# Altium schematic sheet Power.SchDoc
size A3; SheetNumber: 3; SheetTotal: 3
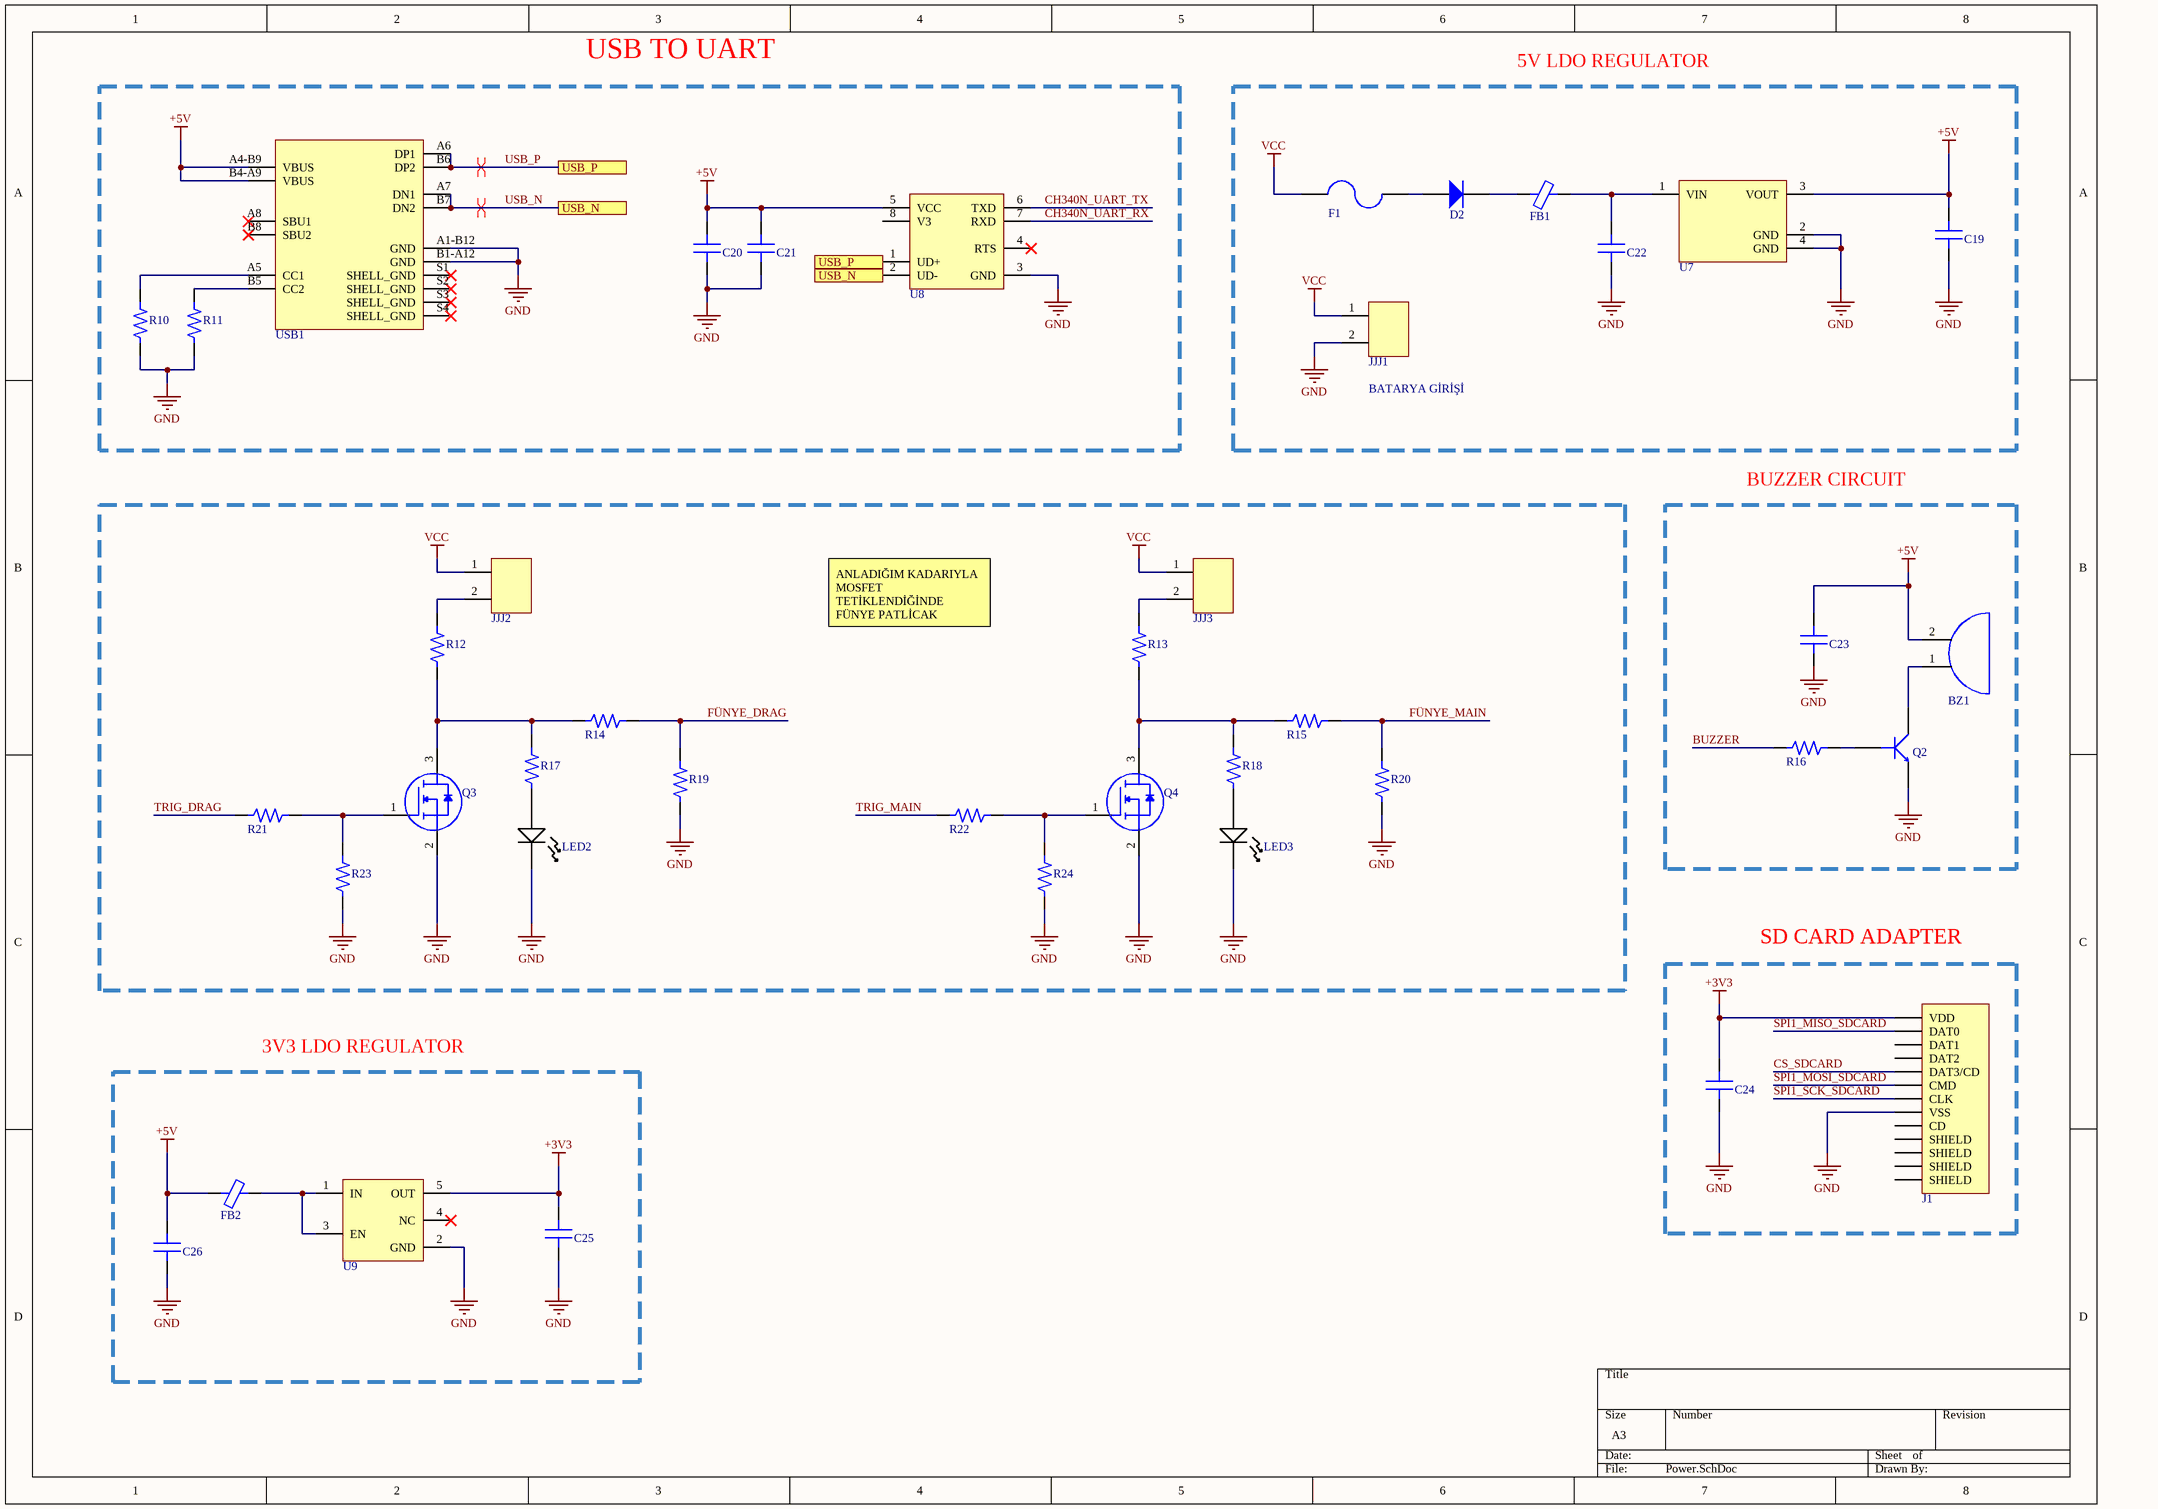
[diagram p0: Power.SchDoc]

## Parts
BZ1  CMI-9605IC-0580T  [BUZZER]  (value not drawn)
C19  CAP CER 10uF 0805  [CAP_0805]  (value not drawn)
C20  CAP CER 100nF 0805  [CAP_0805]  (value not drawn)
C21  CAP CER 100nF 0805  [CAP_0805]  (value not drawn)
C22  CAP CER 10uF 0805  [CAP_0805]  (value not drawn)
C23  CAP CER 100nF 0805  [CAP_0805]  (value not drawn)
C24  CAP CER 100nF 0805  [CAP_0805]  (value not drawn)
C25  CAP CER 1uF 0805  [CAP_0805]  (value not drawn)
C26  CAP CER 1uF 0805  [CAP_0805]  (value not drawn)
D2  DIODE GEN PURP 75V 150MA SOD323F  [SOD323F]  (value not drawn)
F1  FUSE 3413.0216.22  [FUSE_1206]  (value not drawn)
FB1  MPZ2012S601AT000  [FERRITE BEAD_0805]  (value not drawn)
FB2  MPZ2012S601AT000  [FERRITE BEAD_0805]  (value not drawn)
J1  MEM2075-00-140-01-A  [SD CARD]  (value not drawn)
JJJ1  HEADER x2  [HEADER x2]  (value not drawn)
JJJ2  HEADER x2  [HEADER x2]  (value not drawn)
JJJ3  HEADER x2  [HEADER x2]  (value not drawn)
LED2  CMD17-21VRD/TR8  [LED RED_0805]  (value not drawn)
LED3  CMD17-21VRD/TR8  [LED RED_0805]  (value not drawn)
Q2  MMBT3904-7-F  [SOT_23F]  (value not drawn)
Q3  NTR5103NT1G  [SOT-23-3]  (value not drawn)
Q4  NTR5103NT1G  [SOT-23-3]  (value not drawn)
R10  RES 10K OHM 0805  [RES_0805]  (value not drawn)
R11  RES 10K OHM 0805  [RES_0805]  (value not drawn)
R12  RES 0 OHM 0805  [RES_0805]  (value not drawn)
R13  RES 0 OHM 0805  [RES_0805]  (value not drawn)
R14  RES 20K OHM 0805  [RES_0805]  (value not drawn)
R15  RES 20K OHM 0805  [RES_0805]  (value not drawn)
R16  RES 100 OHM 0805  [RES_0805]  (value not drawn)
R17  RES 470 OHM 0805  [RES_0805]  (value not drawn)
R18  RES 470 OHM 0805  [RES_0805]  (value not drawn)
R19  RES 10K OHM 0805  [RES_0805]  (value not drawn)
R20  RES 10K OHM 0805  [RES_0805]  (value not drawn)
R21  RES 1K OHM 0805  [RES_0805]  (value not drawn)
R22  RES 1K OHM 0805  [RES_0805]  (value not drawn)
R23  RES 10K OHM 0805  [RES_0805]  (value not drawn)
R24  RES 10K OHM 0805  [RES_0805]  (value not drawn)
U7  MCP1825S-5002E/DB  [SOT-223-3]  (value not drawn)
U8  CH340N  [SOP-8]  (value not drawn)
U9  NCP161ASN330T1G  [SOT-23-5]  (value not drawn)
USB1  USB4125-GF-A  [USB4125-GF-A / Type C USB]  (value not drawn)

## Blocks framed on the sheet
5V LDO REGULATOR: C19 C22 D2 F1 FB1 JJJ1 U7
BUZZER CIRCUIT: BZ1 C23 Q2 R16
SD CARD ADAPTER: C24 J1
3V3 LDO REGULATOR: C25 C26 FB2 U9

## Ports
USB_N, USB_P

## Nets
+3V3: C24.2 C25.2 J1.P4(VDD) U9.5(OUT)
+5V: BZ1.2 C19.2 C20.2 C21.2 C23.2 C26.2 FB2.1 U7.3(VOUT) U8.5(VCC) USB1.A4-B9(VBUS) USB1.B4-A9(VBUS)
GND: C19.1 C20.1 C21.1 C22.1 C23.1 C24.1 C25.1 C26.1 J1.P6(VSS) JJJ1.2 LED2.2 LED3.2 Q2.2(E) Q3.2(S) Q4.2(S) R10.1 R11.1 R19.1 R20.1 R23.1 R24.1 U7.2(GND) U7.4(GND) U8.3(GND) U9.2(GND) USB1.A1-B12(GND) USB1.B1-A12(GND)
VCC: F1.1 JJJ1.1 JJJ2.1 JJJ3.1
BUZZER: R16.1
CH340N_UART_RX: U8.7(RXD)
CH340N_UART_TX: U8.6(TXD)
CS_SDCARD: J1.P2(DAT3/CD)
FÜNYE_DRAG: R14.2 R19.2
FÜNYE_MAIN: R15.2 R20.2
SPI1_MISO_SDCARD: J1.P7(DAT0)
SPI1_MOSI_SDCARD: J1.P3(CMD)
SPI1_SCK_SDCARD: J1.P5(CLK)
TRIG_DRAG: R21.1
TRIG_MAIN: R22.1
USB_N: U8.2(UD-) USB1.A7(DN1) USB1.B7(DN2) ; port USB_N
USB_P: U8.1(UD+) USB1.A6(DP1) USB1.B6(DP2) ; port USB_P
NetBZ1_1: BZ1.1 Q2.3(C)
NetC22_2: C22.2 FB1.2 U7.1(VIN)
NetD2_1: D2.1(CATHODE) FB1.1
NetD2_2: D2.2(ANODE) F1.2
NetFB2_2: FB2.2 U9.1(IN) U9.3(EN)
NetJJJ2_2: JJJ2.2 R12.2
NetJJJ3_2: JJJ3.2 R13.2
NetLED2_1: LED2.1 R17.1
NetLED3_1: LED3.1 R18.1
NetQ2_1: Q2.1(B) R16.2
NetQ3_1: Q3.1(G) R21.2 R23.2
NetQ3_3: Q3.3(D) R12.1 R14.1 R17.2
NetQ4_1: Q4.1(G) R22.2 R24.2
NetQ4_3: Q4.3(D) R13.1 R15.1 R18.2
NetR10_2: R10.2 USB1.A5(CC1)
NetR11_2: R11.2 USB1.B5(CC2)

Not connected (* = marked no-connect by the designer): J1 P1(DAT2) P8(DAT1) P9(CD) SH1(SHIELD) SH2(SHIELD) SH3(SHIELD) SH4(SHIELD); U8 4(RTS)* 8(V3); U9 4(NC)*; USB1 A8(SBU1)* B8(SBU2)* S1(SHELL_GND)* S2(SHELL_GND)* S3(SHELL_GND)* S4(SHELL_GND)*

## Layout directives
differential pair: USB_N, USB_P

## Notes on the sheet
- USB TO UART
- BURDAKİ DIFFERENTIAL 'ların OLMASI GEREKTİĞİNDEN EMİN DEĞİLİM
- (near JJJ1) BATARYA GİRİŞİ
- 5V DC
- ANLADIĞIM KADARIYLA MOSFET TETİKLENDİĞİNDE FÜNYE PATLİCAK
- (near J1) A standard microSD card has an operating voltage of 3.3 V. As a result, we cannot connect it directly to circuits that use 5V logic; in fact, any voltages above 3.6V may permanently damage the microSD card. That is why the module includes an onboard ultra-low dropout voltage regulator capable of regulating voltage to 3.3V.
- LDO regülatör sabit bir voltaj çıkarabilir ve giriş çıkış arasında potansiyel farkın düşük old devrelerde kullanılır.
- CS pini output olarak belirlendi, stm pinlerinde SPI1_NSS / SPI3_NSS / ADC12_IN4 / DAC_OUT1 olarak tanımlanan PA4 pinine atandı.
- (near U9) Datasheet'te EN pininin input voltajıyla aynı olduğu görülüyo
- - Yüksek frekanslı gürültü ve istenmeyen durumlarda, belirlenen frekans aralığının dışında direnç etkisi gösterir, gürültüyü ısı enerjisine çevirerek absorbe ederler. Devrede güç veya sinyal hattına seri bağlanırlar ve alçak geçiren filtre elde edilir.
  - Elektromanyetik ve radyo frekans girşimini azaltır.
  -Kısaca yüksek frekanstaki sinyalleri önleyen pasif bir komponenttir.
  -Bypass kondansatörleri ile ferritler güç bağlantısında beraber kullanılır.

## Library data of the parts
BZ1 = BUZZER: Audio Buzzer Magnetic 3VDC 7VDC 30mA 5VDC 85dB 2600Hz to 2800Hz Through Hole Pin Box; Manufacturer: CUI Devices; Supplier 1: Digi-Key; Manufacturer Part Number: CMI-9605IC-0580T; RoHS: No; Category: Audio Products; Stock 1: 6842; Pricing 1: 1=1,43000, 10=1,19000, 25=1,10160, 50=1,03700, 100=0,97450, 500=0,83848, 1000=0,78382, 5000=0,76810 (USD); Supplier Part Number 1: 2223-CMI-9605IC-0580T-ND
D2 = DIODE: VR=75V IF=150mA Trr=4ns P=200mW; Manufacturer: ON Semiconductor / Fairchild; Manufacturer Part Number: 1N4148WS; Element Configuration: Single; Reverse Recovery Time: 4ns; Forward Voltage: 1V; Max Reverse Current: 5uA; Power Dissipation: 200mW; Max Forward Surge Current (Ifsm): 2A; Supplier 1: Digi-Key; RoHS: Yes; Category: Rectifier Diodes; Stock 1: 973654; Pricing 1: 1=0,21000, 10=0,19200, 100=0,10460, 500=0,06436, 1000=0,04388 (USD); Mount: Surface Mount; Number of Pins: 2; Contact Plating: Tin,Matte; Weight: 0.0276g; Min Operating Temperature: -55°C; Max Operating Temperature: 150°C; Packaging: Tape and Reel; Forward Current: 150mA; Max Repetitive Reverse Voltage (Vrrm): 75V; Package Quantity: 1; Average Rectified Current: 150mA; Max Reverse Voltage (DC): 75V; Recovery Time: 4ns; Series: -; Reverse Voltage: 75V; Length: 1.8mm; Width: 1.35mm; Height: 1mm; Radiation Hardening: No; RoHS Compliant: Yes; Lead Free: Lead Free; Reach SVHC Compliant: Yes; ComponentLink1URL: https://datasheet.ciiva.com/30479/0900766b810e1cd3-30479206.pdf?src-supplier=Rs; ComponentLink1Description: https://datasheet.ciiva.com/30479/0900766b810e1cd3-30479206.pdf?src-supplier=Rs; ComponentLink2URL: https://datasheet.ciiva.com/15208/getdatasheetpartid-127819-15208358.pdf?src-supplier=Verical; ComponentLink2Description: https://datasheet.ciiva.com/15208/getdatasheetpartid-127819-15208358.pdf?src-supplier=Verical; ComponentLink3URL: https://datasheet.ciiva.com/8300/1n914bws-8300360.pdf?src-supplier=Avnet; ComponentLink3Description: https://datasheet.ciiva.com/8300/1n914bws-8300360.pdf?src-supplier=Avnet; ComponentLink4URL: https://datasheet.ciiva.com/910/1n4148ws-910381.pdf?src-supplier=Digi-Key; ComponentLink4Description: https://datasheet.ciiva.com/910/1n4148ws-910381.pdf?src-supplier=Digi-Key; ComponentLink5URL: https://datasheet.ciiva.com/910/1n4148ws-910382.pdf?src-supplier=Digi-Key; ComponentLink5Description: https://datasheet.ciiva.com/910/1n4148ws-910382.pdf?src-supplier=Digi-Key; ComponentLink6URL: https://datasheet.ciiva.com/910/1n4148ws-910380.pdf?src-supplier=Digi-Key; ComponentLink6Description: https://datasheet.ciiva.com/910/1n4148ws-910380.pdf?src-supplier=Digi-Key; Supplier Part Number 1: 1N4148WSFSDKR-ND
F1 = FUSE: Fuse Chip Fast Acting 1A 32V SMD Solder Pad 1206 Glass T/R VDE/cULus; Manufacturer: Schurter; Body Material: Glass,Epoxy; Max Voltage Rating (DC): 63V; DC Cold Resistance: 94.2mR; Fuse Type: Board Mount (Cartridge Style Excluded); Approvals: VDE,cURus; Supplier 1: Digi-Key; Manufacturer Part Number: 3413.0216.22; RoHS: Yes; Category: Fuses; Stock 1: 6832; Pricing 1: 1=0,67000, 50=0,52400, 100=0,39700, 500=0,32624 (USD); Mount: Surface Mount,PCB; Case/Package: 1206; Number of Pins: 2; Weight: 0.000212oz; Case Code (Metric): 3216; Case Code (Imperial): 1206; Contact Plating: Gold; Housing Material: Glass; Terminal Material: Tin; Min Operating Temperature: -55°C; Max Operating Temperature: 90°C; Current Rating: 1A; Package Quantity: 1000; Voltage Rating (AC): 32V; Voltage Rating (DC): 63V; Packaging: Tape and Reel; Max Voltage Rating (AC): 32V; Voltage Rating: 32V; Termination: SMD/SMT; Working Voltage: 32V; Series: USI 1206; Length: 3.2mm; Width: 1.6mm; Height: 0.6mm; Depth: 1.6mm; Radiation Hardening: No; Lead Free: Lead Free; RoHS Compliant: Yes; ComponentLink1URL: https://datasheet.ciiva.com/301/typ-usi-1206-301440.pdf?src-supplier=Digi-Key; ComponentLink1Description: https://datasheet.ciiva.com/301/typ-usi-1206-301440.pdf?src-supplier=Digi-Key; ComponentLink2URL: https://datasheet.ciiva.com/14541/70160006-14541114.pdf?src-supplier=Allied+Electronics; ComponentLink2Description: https://datasheet.ciiva.com/14541/70160006-14541114.pdf?src-supplier=Allied+Electronics; ComponentLink3URL: https://datasheet.ciiva.com/301/typ-usi-1206-301439.pdf?src-supplier=Digi-Key; ComponentLink3Description: https://datasheet.ciiva.com/301/typ-usi-1206-301439.pdf?src-supplier=Digi-Key; ComponentLink4URL: https://datasheet.ciiva.com/301/typ-usi-1206-301441.pdf?src-supplier=Digi-Key; ComponentLink4Description: https://datasheet.ciiva.com/301/typ-usi-1206-301441.pdf?src-supplier=Digi-Key; ComponentLink5URL: https://datasheet.ciiva.com/8264/typ-usi-1206-8264583.pdf?src-supplier=Avnet; ComponentLink5Description: https://datasheet.ciiva.com/8264/typ-usi-1206-8264583.pdf?src-supplier=Avnet; ComponentLink6URL: https://datasheet.ciiva.com/14102/qousi1206-data-e-14102903.pdf?src-supplier=Distrelec; ComponentLink6Description: https://datasheet.ciiva.com/14102/qousi1206-data-e-14102903.pdf?src-supplier=Distrelec; ComponentLink7URL: https://datasheet.ciiva.com/16316/typ-usi-1206-16316588.pdf?src-supplier=Future+Electronics; ComponentLink7Description: https://datasheet.ciiva.com/16316/typ-usi-1206-16316588.pdf?src-supplier=Future+Electronics; Supplier Part Number 1: 486-1144-1-ND
FB1 FB2 = FERRITE BEAD: 0805 600Ω ±25% DCR=0.1Ω 2A; Manufacturer: TDK; Impedance: 600R; DC Resistance (DCR): 100mR; Number of Lines: 1; Supplier 1: Digi-Key; Manufacturer Part Number: MPZ2012S601AT000; RoHS: Yes; Category: Ferrite Beads and Chips; Stock 1: 1942; Pricing 1: 1=0,11000, 10=0,09200, 25=0,08320, 50=0,06100, 100=0,05270, 250=0,04160, 500=0,03512, 1000=0,02957 (USD); Mount: Surface Mount; Case/Package: 0805; Case Code (Metric): 2012; Case Code (Imperial): 0805; Min Operating Temperature: -55°C; Max Operating Temperature: 125°C; Packaging: Tape and Reel; Package Quantity: 1; Current Rating: 2A; Max DC Current: 2A; Series: MPZ; Max Current Rating: 2A; Length: 0.079inch; Width: 0.049inch; Height: 0.041inch; Reach SVHC Compliant: Yes; Lead Free: Lead Free; RoHS Compliant: Yes; ComponentLink1URL: https://datasheet.ciiva.com/46634/beads-commercial-power-mpz-en-46634335.pdf?src-supplier=Digi-Key; ComponentLink1Description: https://datasheet.ciiva.com/46634/beads-commercial-power-mpz-en-46634335.pdf?src-supplier=Digi-Key; ComponentLink2URL: https://datasheet.ciiva.com/46634/beads-commercial-power-mpz-en-46634377.pdf?src-supplier=Digi-Key; ComponentLink2Description: https://datasheet.ciiva.com/46634/beads-commercial-power-mpz-en-46634377.pdf?src-supplier=Digi-Key; ComponentLink3URL: https://datasheet.ciiva.com/46634/beads-commercial-power-mpz-en-46634606.pdf?src-supplier=Digi-Key; ComponentLink3Description: https://datasheet.ciiva.com/46634/beads-commercial-power-mpz-en-46634606.pdf?src-supplier=Digi-Key; Supplier Part Number 1: 445-MPZ2012S601AT000CT-ND
J1 = SD CARD: MEM2075 Series Normally Open SMT Push-Push MicroSD Memory Card Connector; Manufacturer: Global Connector Technology; Supplier 1: Farnell; Manufacturer Part Number: MEM2075-00-140-01-A; RoHS: No; Category: Connectors; Stock 1: 1317; Pricing 1: 1=1,64000, 25=1,55000, 75=1,48000, 200=1,34000, 500=1,24000 (EUR); ComponentLink1URL: https://gct.co/files/drawings/mem2075.pdf?src-supplier=Digi-Key; ComponentLink1Description: https://gct.co/files/drawings/mem2075.pdf?src-supplier=Digi-Key; Supplier Part Number 1: 2895610
JJJ1-JJJ3 = HEADER x2: Conn Screw Type Terminal Block 2 POS 3.5mm Solder ST Thru-Hole 10A; Manufacturer: On-Shore Technology; Manufacturer Part Number: OSTTE020104; Plating: Steel; Number of Levels: 1; Number of Positions Per Level: 2; Voltage: 125V; Pitch: 0.138inch; Wire Gauge (Max): 26AWG; Wire Gauge (Min): 16AWG; Supplier 1: Digi-Key; RoHS: Yes; Category: Terminal Blocks; Stock 1: 73362; Pricing 1: 1=0,74000, 10=0,40200, 25=0,30040, 50=0,26780, 100=0,26260, 250=0,23108, 500=0,21008, 1000=0,18907, 5000=0,14180 (USD); Mount: Through Hole; Number of Pins: 2; Contact Plating: Tin; Color: Black; Housing Material: Thermoplastic; Min Operating Temperature: -30°C; Max Operating Temperature: 105°C; Current: 10A; Termination: Screw; Packaging: Bulk; ComponentLink1URL: http://www.on-shore.com/wp-content/uploads/2015/09/osttexx0164.pdf?src-supplier=Digi-Key; ComponentLink1Description: http://www.on-shore.com/wp-content/uploads/2015/09/osttexx0164.pdf?src-supplier=Digi-Key; ComponentLink2URL: http://www.on-shore.com/wp-content/uploads/2015/09/osttexx0164.pdf?src-supplier=Verical; ComponentLink2Description: http://www.on-shore.com/wp-content/uploads/2015/09/osttexx0164.pdf?src-supplier=Verical; ComponentLink3URL: http://www.on-shore.com/wp-content/uploads/2015/09/osttexx0164.pdf?src-supplier=Arrow+Electronics; ComponentLink3Description: http://www.on-shore.com/wp-content/uploads/2015/09/osttexx0164.pdf?src-supplier=Arrow+Electronics; Supplier Part Number 1: ED2740-ND
LED2 LED3 = LED RED: LED Uni-Color Red 640nm 2-Pin SMT T/R; Manufacturer: VCC CHML; Power Rating: 100mW; Luminous Intensity: 6mcd; Viewing Angle: 140°; Lens Style: Diffused,Tinted,Rectangular,Colored; Forward Current: 20mA; Forward Voltage: 2V; Reverse Voltage (DC): 5V; Number of LEDs: 1; Supplier 1: Digi-Key; Manufacturer Part Number: CMD17-21VRD/TR8; RoHS: Yes; Category: LEDs; Stock 1: 357228; Pricing 1: 1=0,73000, 10=0,47800, 100=0,31310, 1000=0,24720 (USD); Mount: Surface Mount; Case/Package: 0805; Number of Pins: 2; Color: Red; Case Code (Metric): 2012; Case Code (Imperial): 0805; Lens Color: Red; Min Operating Temperature: -40°C; Max Operating Temperature: 85°C; Packaging: Tape and Reel; Package Quantity: 1; Illumination Color: Red; Test Current: 20mA; Wavelength: 640nm; Reverse Voltage: 5V; Length: 2mm; Width: 1.25mm; Height: 1.1mm; RoHS Compliant: Yes; Lead Free: Lead Free; ComponentLink1URL: http://www.mouser.com/ds/2/423/CMD1721ver1-1064576.pdf?src-supplier=Mouser; ComponentLink1Description: http://www.mouser.com/ds/2/423/CMD1721ver1-1064576.pdf?src-supplier=Mouser; ComponentLink2URL: https://www.alliedelec.com/m/d/ea8f758becbd32522d2612194452bcae.pdf?src-supplier=Allied+Electronics; ComponentLink2Description: https://www.alliedelec.com/m/d/ea8f758becbd32522d2612194452bcae.pdf?src-supplier=Allied+Electronics; ComponentLink3URL: http://www.onlinecomponents.com/productFiles/mf-CM/2cmd17-21seriessmtleds0805packagesize.pdf?src-supplier=Onlinecomponents.com; ComponentLink3Description: http://www.onlinecomponents.com/productFiles/mf-CM/2cmd17-21seriessmtleds0805packagesize.pdf?src-supplier=Onlinecomponents.com; ComponentLink4URL: https://vcclite.com/wp-content/uploads/wpallimport/files/files/CMD1721Seriesver3.pdf?src-supplier=Digi-Key; ComponentLink4Description: https://vcclite.com/wp-content/uploads/wpallimport/files/files/CMD1721Seriesver3.pdf?src-supplier=Digi-Key; Supplier Part Number 1: L62501CT-ND
Q2 = BJT_NPN: NPN Ic=200mA Vceo=40V hfe=100~300 fT=310MHz P=300mW SOT-23; Manufacturer: Diodes Zetex; Max Power Dissipation: 300mW; Collector Emitter Voltage (VCEO): 40V; Max Collector Current: 200mA; Collector Base Voltage (VCBO): 60V; Power Dissipation: 350mW; Frequency: 300MHz; hFE Min: 100; Number of Elements: 1; Emitter Base Voltage (VEBO): 6V; Collector Emitter Saturation Voltage: 300mV; Element Configuration: Single; Supplier 1: Digi-Key; Manufacturer Part Number: MMBT3904-7-F; RoHS: Yes; Category: BJTs; Stock 1: 7729144; Pricing 1: 1=0,13000, 10=0,11700, 100=0,06370, 500=0,03918, 1000=0,02671 (USD); Mount: Surface Mount; Case/Package: SOT-23; Number of Pins: 3; Weight: 0.000282oz; Contact Plating: Tin,Matte; Min Operating Temperature: -55°C; Max Operating Temperature: 150°C; Polarity: NPN; Packaging: Tape and Reel; Package Quantity: 3000; Transition Frequency: 300MHz; Collector Emitter Breakdown Voltage: 40V; Max Breakdown Voltage: 40V; Continuous Collector Current: 200mA; Max Frequency: 300MHz; Gain Bandwidth Product: 300MHz; Voltage Rating (DC): 40V; Series: Automotive, AEC-Q101; Collector-emitter Voltage-Max: 300mV; Length: 3.05mm; Width: 1.4mm; Height: 1mm; Radiation Hardening: No; Reach SVHC Compliant: Yes; Lead Free: Lead Free; RoHS Compliant: Yes; ComponentLink1URL: https://datasheet.ciiva.com/11201/ds30036-11201778.pdf?src-supplier=Avnet; ComponentLink1Description: https://datasheet.ciiva.com/11201/ds30036-11201778.pdf?src-supplier=Avnet; ComponentLink2URL: https://datasheet.ciiva.com/15138/getdatasheetpartid-53265-15138780.pdf?src-supplier=Verical; ComponentLink2Description: https://datasheet.ciiva.com/15138/getdatasheetpartid-53265-15138780.pdf?src-supplier=Verical; ComponentLink3URL: https://datasheet.ciiva.com/22711/1915516-22711750.pdf?src-supplier=Element14; ComponentLink3Description: https://datasheet.ciiva.com/22711/1915516-22711750.pdf?src-supplier=Element14; ComponentLink4URL: https://datasheet.ciiva.com/11198/ds30036-11198999.pdf?src-supplier=Avnet; ComponentLink4Description: https://datasheet.ciiva.com/11198/ds30036-11198999.pdf?src-supplier=Avnet; ComponentLink5URL: https://datasheet.ciiva.com/6361/ds30036-6361256.pdf?src-supplier=Digi-Key; ComponentLink5Description: https://datasheet.ciiva.com/6361/ds30036-6361256.pdf?src-supplier=Digi-Key; ComponentLink6URL: https://datasheet.ciiva.com/6361/ds30036-6361254.pdf?src-supplier=Digi-Key; ComponentLink6Description: https://datasheet.ciiva.com/6361/ds30036-6361254.pdf?src-supplier=Digi-Key; Supplier Part Number 1: MMBT3904-FDICT-ND
Q3 Q4 = MOSFET N-Channel: MOSFET N-CH 60V 0.26A SOT23; Manufacturer: ON Semiconductor; Continuous Drain Current (ID): 310mA; Rds On Max: 2.5R; Input Capacitance: 40pF; Max Power Dissipation: 300mW; Number of Channels: 1; Drain to Source Resistance: 1R; Gate to Source Voltage (Vgs): 30V; Fall Time: 3.6ns; Rise Time: 1.2ns; Turn-Off Delay Time: 4.8ns; Turn-On Delay Time: 1.7ns; FET Type: 1 N-Channel; Supplier 1: Digi-Key; Manufacturer Part Number: NTR5103NT1G; RoHS: Yes; Category: MOSFETs; Stock 1: 55356; Pricing 1: 1=0,25000, 10=0,20100, 100=0,10660, 500=0,07012, 1000=0,04768 (USD); Mount: Surface Mount; Case/Package: SOT-23-3; Number of Pins: 3; Contact Plating: Tin; Min Operating Temperature: -55°C; Max Operating Temperature: 150°C; Packaging: Tape and Reel; Drain to Source Voltage (Vdss): 60V; Drain to Source Breakdown Voltage: 60V; Package Quantity: 3000; Lead Free: Lead Free; RoHS Compliant: Yes; ComponentLink1URL: http://www.farnell.com/datasheets/2237046.pdf?src-supplier=Farnell; ComponentLink1Description: http://www.farnell.com/datasheets/2237046.pdf?src-supplier=Farnell; ComponentLink2URL: http://www.mouser.com/ds/2/308/NTR5103N-D-600006.pdf?src-supplier=Mouser; ComponentLink2Description: http://www.mouser.com/ds/2/308/NTR5103N-D-600006.pdf?src-supplier=Mouser; ComponentLink3URL: http://www.farnell.com/datasheets/2237046.pdf?src-supplier=Newark; ComponentLink3Description: http://www.farnell.com/datasheets/2237046.pdf?src-supplier=Newark; ComponentLink4URL: http://www.farnell.com/datasheets/2237046.pdf?src-supplier=Element14; ComponentLink4Description: http://www.farnell.com/datasheets/2237046.pdf?src-supplier=Element14; ComponentLink5URL: http://www.onsemi.com/pub/Collateral/NTR5103N-D.PDF?src-supplier=Avnet; ComponentLink5Description: http://www.onsemi.com/pub/Collateral/NTR5103N-D.PDF?src-supplier=Avnet; ComponentLink6URL: http://www.onsemi.com/pub/Collateral/NTR5103N-D.PDF?src-supplier=Digi-Key; ComponentLink6Description: http://www.onsemi.com/pub/Collateral/NTR5103N-D.PDF?src-supplier=Digi-Key; Supplier Part Number 1: NTR5103NT1GOSCT-ND
U7 = MCP1825S-5002E/DB: IC; Linear Regulator; Max. Input; 6V; Output; 5V; 500MA; Accuracy; 0.5%; SOT223-3; Manufacturer: Microchip; Dropout Voltage: 210mV; Min Input Voltage: 2.1V; Number of Outputs: 1; Input Bias Current: 120uA; Quiescent Current: 220uA; Polarity: Positive; Output Type: Fixed; Supplier 1: Digi-Key; Manufacturer Part Number: MCP1825S-5002E/DB; RoHS: Yes; Category: Voltage Regulators - Linear; Stock 1: 2498; Pricing 1: 1=0,69000, 25=0,58320, 100=0,53000 (USD); Mount: Surface Mount; Case/Package: SOT-223; Number of Pins: 3; Min Operating Temperature: -40°C; Max Operating Temperature: 125°C; Package Quantity: 78; Max Input Voltage: 6V; Output Current: 500mA; Output Voltage: 5V; Packaging: Rail/Tube; Max Output Current: 500mA; Min Output Voltage: 5V; Accuracy: 0.5%; Nominal Output Voltage: 5V; Output Voltage Accuracy: 0.5%; Length: 6.5mm; Width: 3.5mm; Height: 1.6mm; Radiation Hardening: No; Reach SVHC Compliant: Yes; Lead Free: Lead Free; RoHS Compliant: Yes; ComponentLink1URL: https://datasheet.ciiva.com/41458/001085970-da-01-en-ic-reg-l-mcp1825s-5002e-db-sot-223-3-mcp-41458813.pdf?src-supplier=Conrad; ComponentLink1Description: https://datasheet.ciiva.com/41458/001085970-da-01-en-ic-reg-l-mcp1825s-5002e-db-sot-223-3-mcp-41458813.pdf?src-supplier=Conrad; ComponentLink2URL: https://datasheet.ciiva.com/8041/514217-8041503.pdf?src-supplier=Element14; ComponentLink2Description: https://datasheet.ciiva.com/8041/514217-8041503.pdf?src-supplier=Element14; ComponentLink3URL: https://datasheet.ciiva.com/8239/22056b-8239274.pdf?src-supplier=Avnet; ComponentLink3Description: https://datasheet.ciiva.com/8239/22056b-8239274.pdf?src-supplier=Avnet; ComponentLink4URL: https://datasheet.ciiva.com/16298/filehandler-aspxddocname-en531698-16298391.pdf?src-supplier=Future+Electronics; ComponentLink4Description: https://datasheet.ciiva.com/16298/filehandler-aspxddocname-en531698-16298391.pdf?src-supplier=Future+Electronics; ComponentLink5URL: https://datasheet.ciiva.com/15200/getdatasheetpartid-567689-15200326.pdf?src-supplier=Verical; ComponentLink5Description: https://datasheet.ciiva.com/15200/getdatasheetpartid-567689-15200326.pdf?src-supplier=Verical; ComponentLink6URL: https://datasheet.ciiva.com/2051/22056b-2051733.pdf?src-supplier=Digi-Key; ComponentLink6Description: https://datasheet.ciiva.com/2051/22056b-2051733.pdf?src-supplier=Digi-Key; Supplier Part Number 1: MCP1825S-5002E/DB-ND
U8 = CH340N: USB TO UART TTL CONVERTER - SOP 8 PACKAGE
U9 = NCP161ASN330T1G: LDO Regulator, 450 mA, Ultra-High PSRR, Ultra-Low Noise 3.3V, SOT23-5L, Active Discharge; Manufacturer: ON Semiconductor; Voltage - Input (Max): 5.5V; Current - Output: 450mA; Supplier 1: Digi-Key; Manufacturer Part Number: NCP161ASN330T1G; RoHS: Yes; Category: Voltage Regulators - Linear; Stock 1: 4959; Pricing 1: 1=0,67000, 10=0,58900, 25=0,55320, 100=0,45160, 250=0,41948, 500=0,35700, 1000=0,28561 (USD); RoHS Compliant: Yes; ComponentLink1URL: http://www.farnell.com/datasheets/2815754.pdf?src-supplier=Farnell; ComponentLink1Description: http://www.farnell.com/datasheets/2815754.pdf?src-supplier=Farnell; Supplier Part Number 1: NCP161ASN330T1GOSCT-ND; Voltage - Output (Min/Fixed): 3.3V; Supplier Device Package: SOT-23-5
USB1 = TYPE C USB CONNECTOR: USB Connector with 1.90mm shell stake length; Manufacturer: Global Connector Technology; Manufacturer Part Number: USB4125-GF-A-0190; Supplier 1: Farnell; RoHS: No; Category: USB Connectors; Stock 1: 2000; Pricing 1: 1000=0,40500, 5000=0,39700, 10000=0,38900, 20000=0,38100 (EUR); Supplier Part Number 1: 3777666